# EAGLE design usb_ext_board (EAGLE 7.5.0)
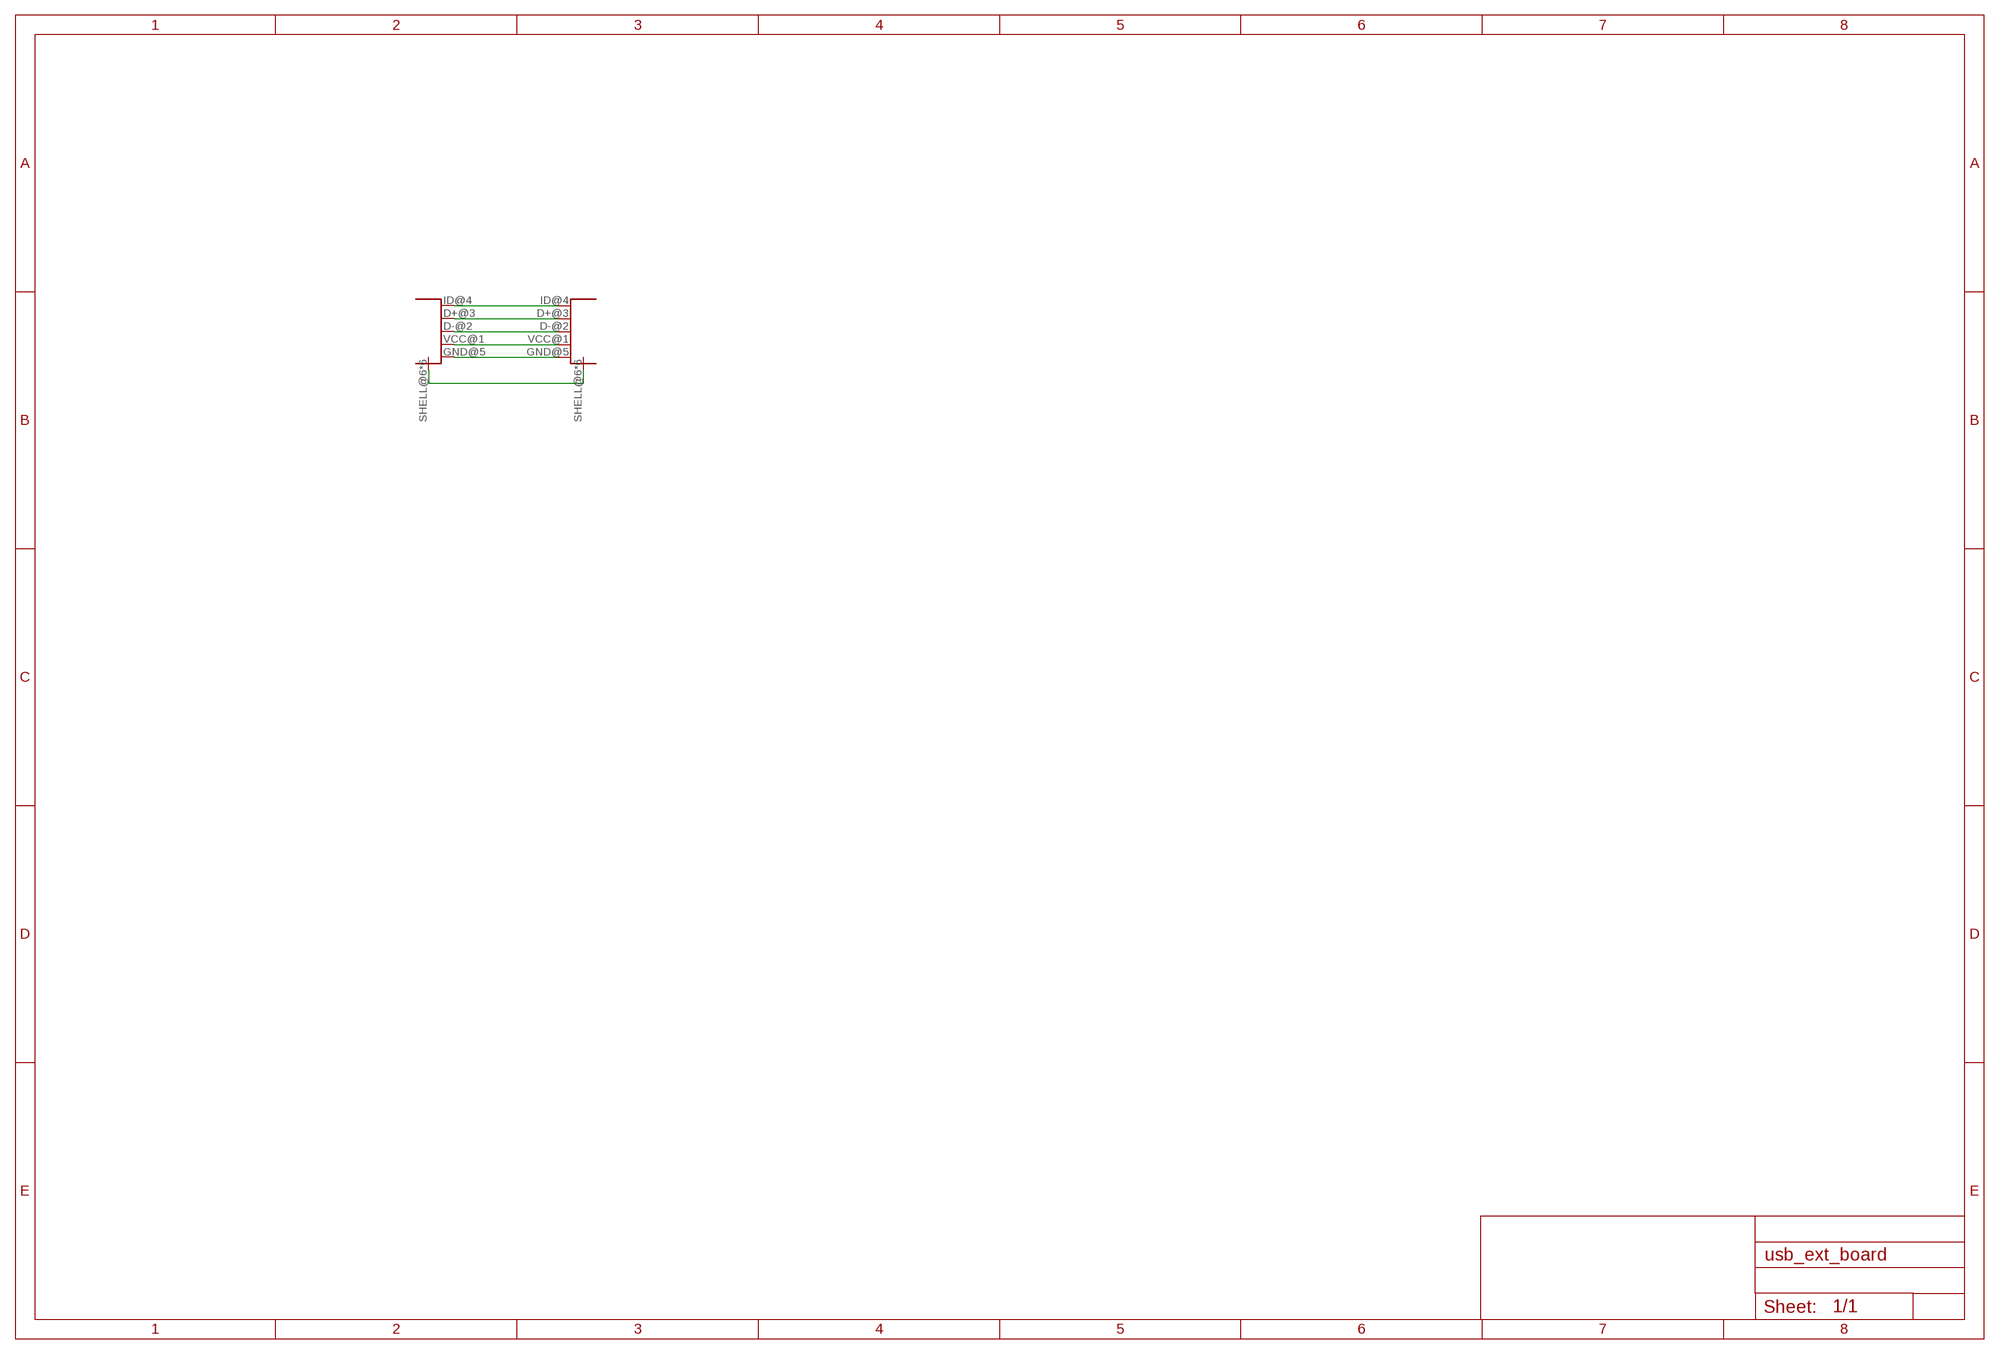
[diagram p0: schematic, sheet 1]

## Parts
MALE1  USB-ID  [USB3150-30-130]
MALE2  USB-ID  [USB3150-30-130]

## Nets
D+: MALE1.D+@3(D+) MALE2.D+@3(D+)
D-: MALE1.D-@2(D-) MALE2.D-@2(D-)
GND: MALE1.GND@5(GND) MALE1.SHELL@6(SHELL) MALE1.SHELL@7(SHELL) MALE1.SHELL@8(SHELL) MALE1.SHELL@9(SHELL) MALE1.SHELL@10(SHELL) MALE1.SHELL@11(SHELL) MALE2.GND@5(GND) MALE2.SHELL@6(SHELL) MALE2.SHELL@7(SHELL) MALE2.SHELL@8(SHELL) MALE2.SHELL@9(SHELL) MALE2.SHELL@10(SHELL) MALE2.SHELL@11(SHELL)
ID: MALE1.ID@4(ID) MALE2.ID@4(ID)
VCC: MALE1.VCC@1(VBUS) MALE2.VCC@1(VBUS)

## Library data of the parts
MALE1 MALE2 = openblw:USB-ID

## Board
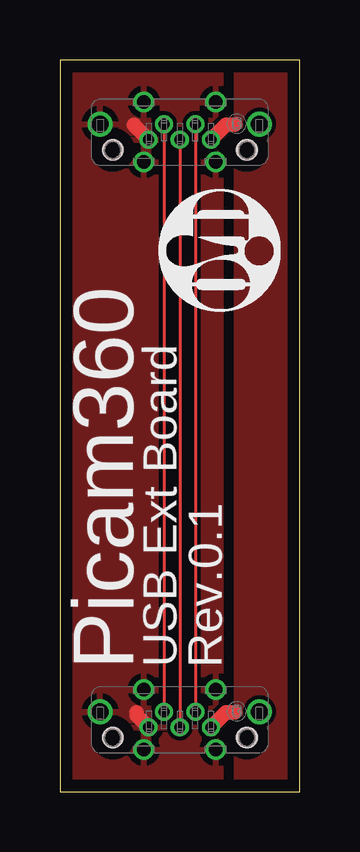
[diagram p1: board, top side]
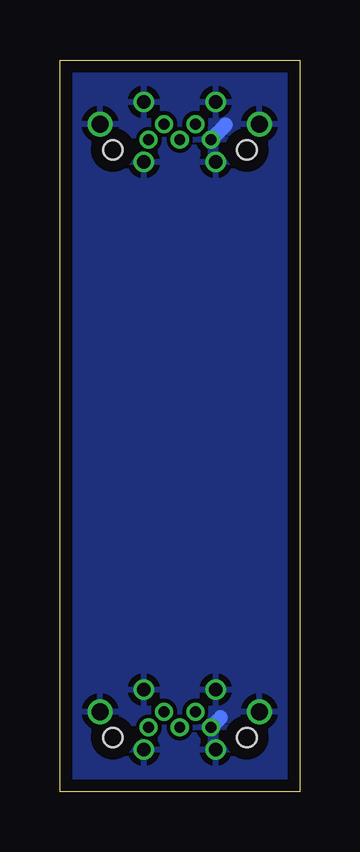
[diagram p2: board, bottom side, seen from below]

Size 10 x 30.5 mm. Coordinates in mm from the lower left corner, seen from the top.
Outline: 0,0 10,0 10,30.5 0,30.5 0,0
Copper layers (1*16): Top 0.035mm / dielectric 1.6mm / Bottom 0.035mm
Design rules "Elecrow_2-layer_PCB_eagle_rule": minimum track width 6mil, minimum drill 12mil, track to track 6mil, track to pad 6mil, pad to pad 6mil, via to via 8mil, smd to smd 0mil, copper to edge 20mil, drill to drill 10mil, minimum pad ring 6mil, minimum via ring 6mil, stop-mask expansion 0mil, vias tented up to drill 100mil, thermal gap 10mil

### Footprints (pad centres in the part's own frame; a part is rotated, then mirrored left to right if it is on the bottom)
USB3150-30-130 = drill 0.45 pad 0.7: D+@3 0,-0.325; D-@2 0.65,0.325; GND@5 -1.3,-0.325; ID@4 -0.65,0.325; VCC@1 1.3,-0.325 | drill 0.55 pad 0.8: SHELL@6 -1.5,1.25; SHELL@7 1.5,1.25; SHELL@8 -1.5,-1.25; SHELL@9 1.5,-1.25 | drill 0.7 pad 0.95: SHELL@10 -3.325,0.325; SHELL@11 3.325,0.325 | hole 0.8: -2.8,-0.745; 2.8,-0.745

### Placement (x,y rotation side)
LOGO1  [OHMYDIGIFAB_LOGO]  6.71,22.57 90 top
MALE1  5,27.5 0 top
MALE2  5,3 0 top

### Tracks (layer width: path | path; a pad name or v marks a point on that pad's centre or on a via)
D+
  Top 0.127: MALE1.D+@3 MALE2.D+@3
D-
  Top 0.127: MALE1.D-@2 MALE2.D-@2
GND
  Top 0.61: MALE1.GND@5 3.1,27.77 3.1,27.8 | MALE2.GND@5 3.2,3.17 3.2,3.3
  Bottom 0.61: MALE1.GND@5 3.1,27.77 3.1,27.8 | MALE2.GND@5 3.3,3.08 3.3,3.1
  pour Top: 0,30.5 6.7,30.5 6.7,0 0,0
  pour Bottom: 10,30.5 0,30.5 0,0 10,0
ID
  Top 0.127: MALE1.ID@4 MALE2.ID@4
VCC
  Top 0.61: MALE1.VCC@1 6.92,27.8 7.3,27.8 | MALE2.VCC@1 6.92,3.3 7.3,3.3
  pour Top: 7.3,30.2 7.3,0.5 9.5,0.5 9.6,30.2

### Text on the board
tPlace: Picam360 | USB Ext Board | Rev.0.1
Document: 11.0mm / 1.6mm / 10.0mm / 1.6mm / margin:0.3mm / total:24.5mm